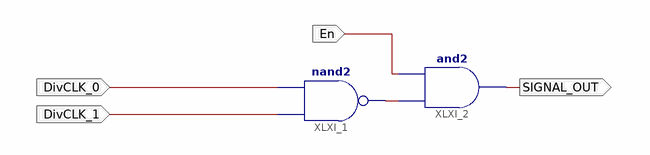
[diagram p0: schematic sheet 1]
// Xilinx ISE schematic RANGER_EN.sch (spartan3e) as structural Verilog: 2 symbols, 4 ports
module RANGER_EN (
  input  DivCLK_0,
  input  DivCLK_1,
  input  En,
  output SIGNAL_OUT
);

  wire XLXN_3;

  nand XLXI_1 (XLXN_3, DivCLK_1, DivCLK_0);
  and XLXI_2 (SIGNAL_OUT, XLXN_3, En);
endmodule
